# Altium project BBTC.PrjPcb
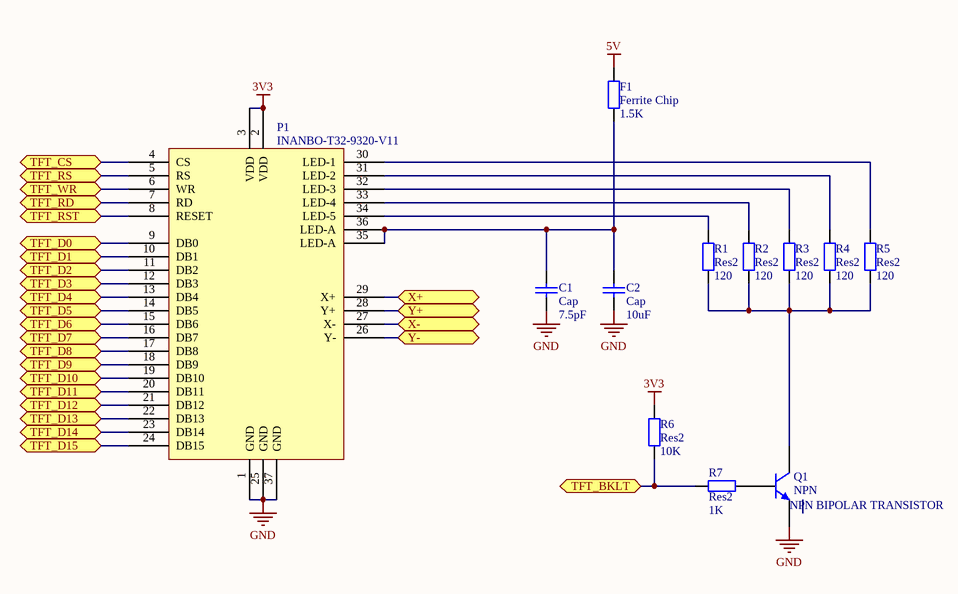
[diagram p0: LCD.SchDoc]
5 sheets, 98 parts. Net scope: flat (ports and power ports of the same name join across sheets).
Sheets:
  LCD.SchDoc
  MAIN.SchDoc
  WIFI.SchDoc
  PSU.SchDoc
  WIRING.SchDoc

## Sheet LCD.SchDoc
size A

### Parts
(Parts that share a designator on the sheet are numbered #1, #2 ... from top to bottom, then left to right.)
C1  Cap  value 7.5pF  [0603]
C2  Cap  value 10uF  [0805]
F1  Ferrite Chip  value 1.5K  [0603]
P1#1  INANBO-T32-9320-V11  [INANBO-T32-ILI9320-V11]
Q1#1  NPN  value NPN BIPOLAR TRANSISTOR  [SOT23_M]
R1#1  Res2  value 120  [0603]
R2#1  Res2  value 120  [0603]
R3  Res2  value 120  [0603]
R4  Res2  value 120  [0603]
R5  Res2  value 120  [0603]
R6  Res2  value 10K  [0603]
R7  Res2  value 1K  [0603]

### Ports
TFT_BKLT, TFT_CS, TFT_D0, TFT_D1, TFT_D2, TFT_D3, TFT_D4, TFT_D5, TFT_D6, TFT_D7, TFT_D8, TFT_D9, TFT_D10, TFT_D11, TFT_D12, TFT_D13, TFT_D14, TFT_D15, TFT_RD, TFT_RS, TFT_RST, TFT_WR, X+, X-, Y+, Y-

### Nets
3V3: P1#1.2(VDD) P1#1.3(VDD) R6.2
5V: F1.1
GND: C1.1 C2.1 P1#1.1(GND) P1#1.25(GND) P1#1.37(GND) Q1#1.3(E)
D0: P1#1.9(DB0) ; port TFT_D0
D1: P1#1.10(DB1) ; port TFT_D1
D2: P1#1.11(DB2) ; port TFT_D2
D3: P1#1.12(DB3) ; port TFT_D3
D4: P1#1.13(DB4) ; port TFT_D4
D5: P1#1.14(DB5) ; port TFT_D5
D6: P1#1.15(DB6) ; port TFT_D6
D7: P1#1.16(DB7) ; port TFT_D7
D8: P1#1.17(DB8) ; port TFT_D8
D9: P1#1.18(DB9) ; port TFT_D9
D10: P1#1.19(DB10) ; port TFT_D10
D11: P1#1.20(DB11) ; port TFT_D11
D12: P1#1.21(DB12) ; port TFT_D12
D13: P1#1.22(DB13) ; port TFT_D13
D14: P1#1.23(DB14) ; port TFT_D14
D15: P1#1.24(DB15) ; port TFT_D15
TFT_BKLT: R6.1 R7.2 ; port TFT_BKLT
TFT_CS: P1#1.4(CS) ; port TFT_CS
TFT_RD: P1#1.7(RD) ; port TFT_RD
TFT_RS: P1#1.5(RS) ; port TFT_RS
TFT_RST: P1#1.8(RESET) ; port TFT_RST
TFT_WR: P1#1.6(WR) ; port TFT_WR
X+: P1#1.29(X+) ; port X+
X-: P1#1.27(X-) ; port X-
Y+: P1#1.28(Y+) ; port Y+
Y-: P1#1.26(Y-) ; port Y-
NetC1_2: C1.2 C2.2 F1.2 P1#1.35(LED-A) P1#1.36(LED-A)
NetP1#1_30: P1#1.30(LED-1) R5.2
NetP1#1_31: P1#1.31(LED-2) R4.2
NetP1#1_32: P1#1.32(LED-3) R3.2
NetP1#1_33: P1#1.33(LED-4) R2#1.2
NetP1#1_34: P1#1.34(LED-5) R1#1.2
NetQ1#1_1: Q1#1.1(C) R1#1.1 R2#1.1 R3.1 R4.1 R5.1
NetQ1#1_2: Q1#1.2(B) R7.1

### Library data of the parts
C1 C2 = Cap: Capacitor; Supplier 1: Digi-Key
  C1: Supplier Part Number 1: 490-3565-1-ND
  C2: Supplier Part Number 1: 445-6857-1-ND
F1 = Res2: Supplier 1: Digi-Key; Supplier Part Number 1: 490-5216-1-ND
P1#1 = ER-TFT032-2: 3.2" TFT LCD module with touch panel; Supplier 1: INANBO; Supplier Part Number 1: INANBO-T32-9320-V11
Q1#1 = NPN: NPN Bipolar Transistor; pin to pad: 2>3 3>2; Supplier Part Number 1: MMBT2222ALT3GOSCT-ND; Supplier 1: Digi-Key
R1#1 R2#1 R3-R7 = Res2: Resistor; Supplier 1: Digi-Key
  R1#1 R2#1 R3-R5: Supplier Part Number 1: P120GCT-ND
  R6: Supplier Part Number 1: P10KGCT-ND
  R7: Supplier Part Number 1: 311-1.0KGRCT-ND

## Sheet MAIN.SchDoc
size B
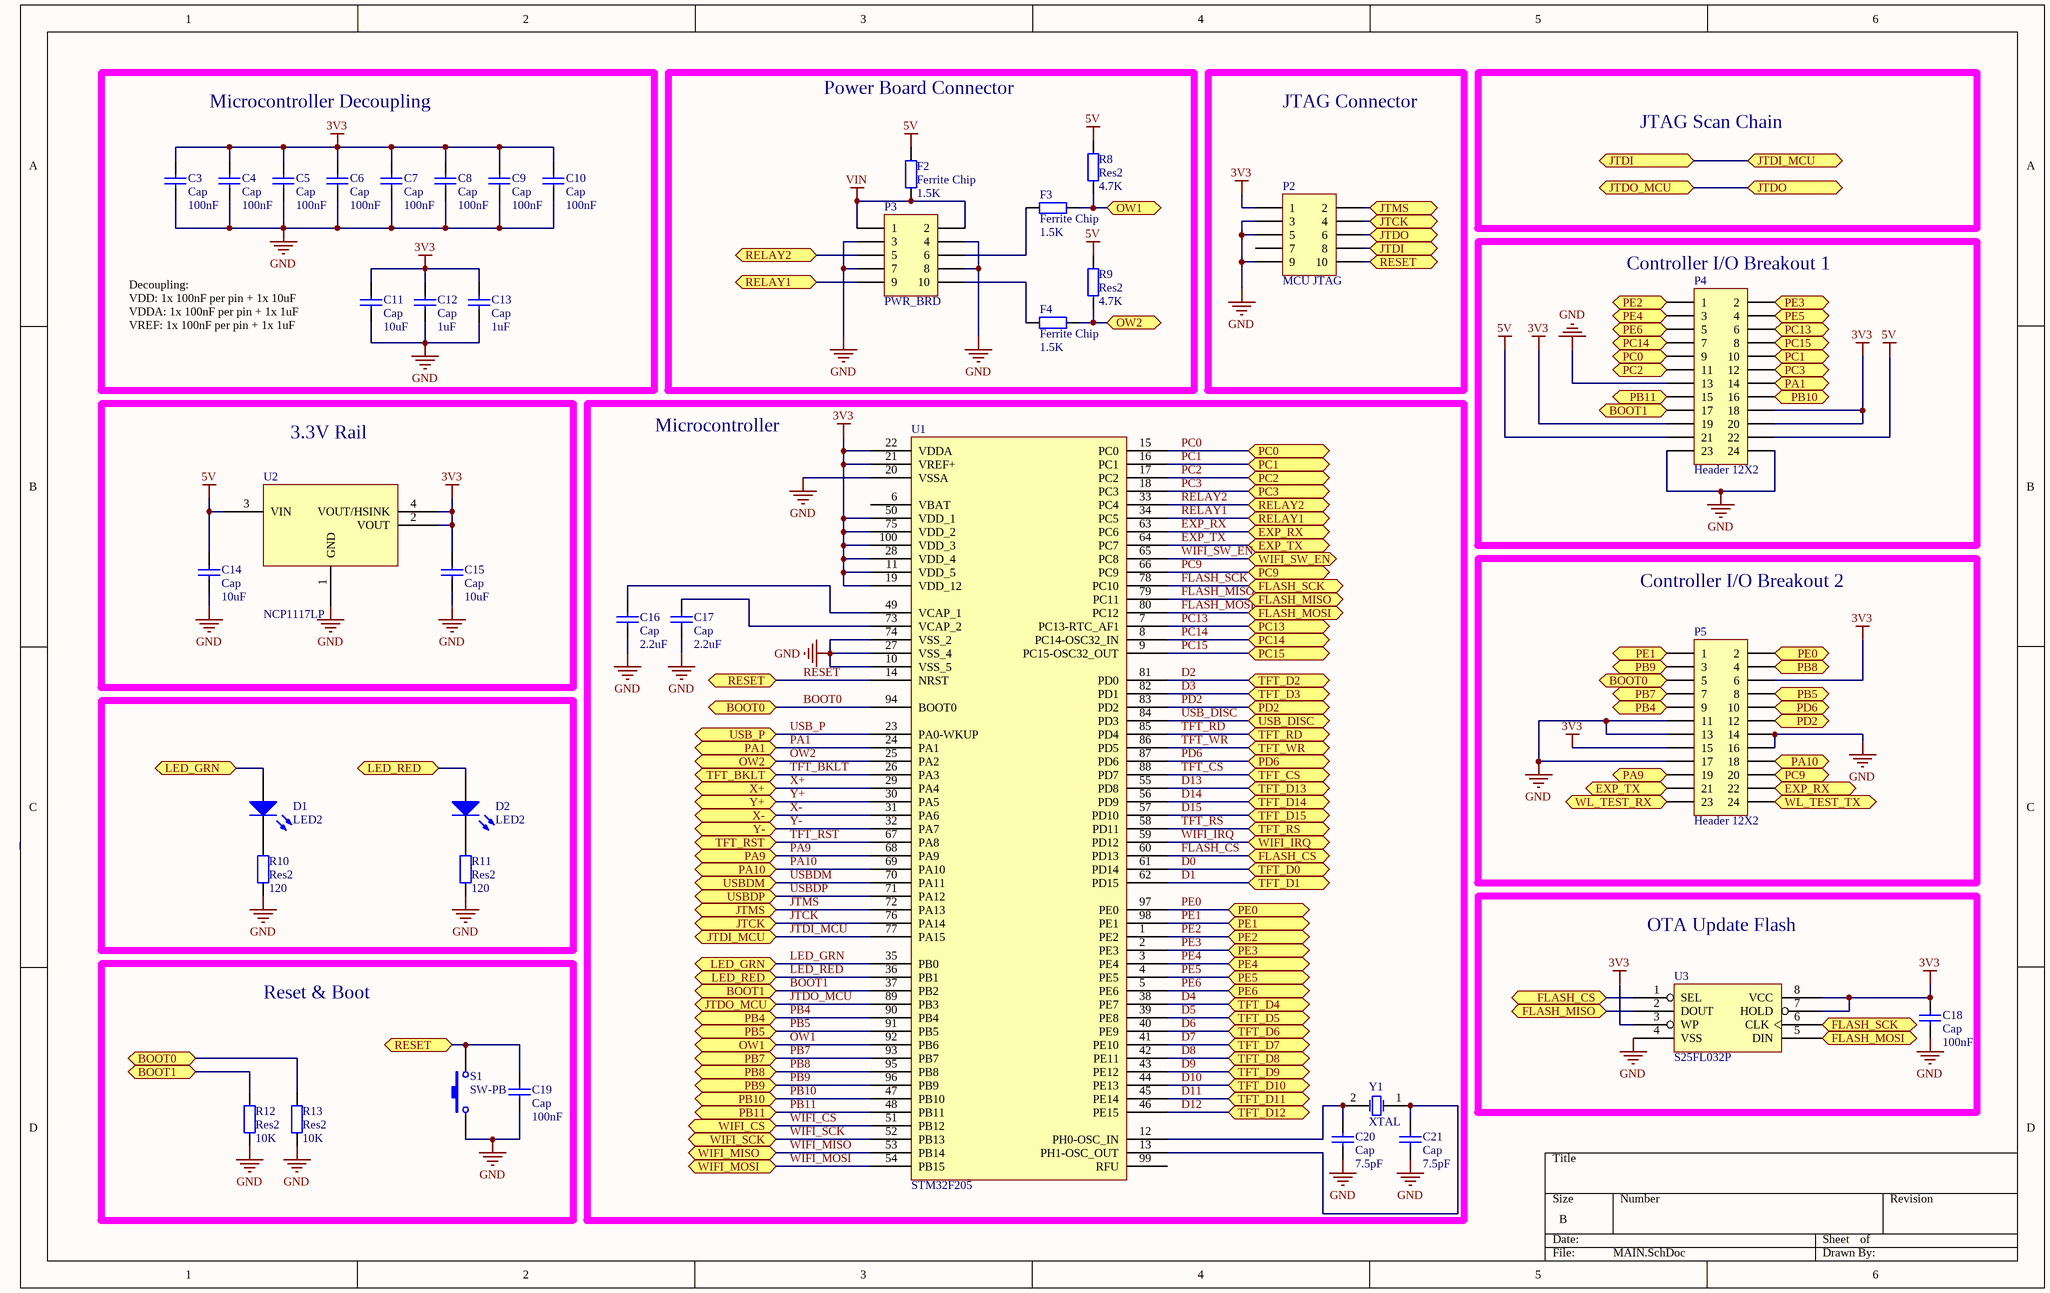
[diagram p1: MAIN.SchDoc]

### Parts
(Parts that share a designator on the sheet are numbered #1, #2 ... from top to bottom, then left to right.)
C3  Cap  value 100nF  [0603]
C4  Cap  value 100nF  [0603]
C5  Cap  value 100nF  [0603]
C6  Cap  value 100nF  [0603]
C7  Cap  value 100nF  [0603]
C8  Cap  value 100nF  [0603]
C9#1  Cap  value 100nF  [0603]
C10#1  Cap  value 100nF  [0603]
C11  Cap  value 10uF  [0805]
C12  Cap  value 1uF  [0603]
C13  Cap  value 1uF  [0603]
C14  Cap  value 10uF  [0805]
C15  Cap  value 10uF  [0805]
C16  Cap  value 2.2uF  [0603]
C17  Cap  value 2.2uF  [0603]
C18  Cap  value 100nF  [0603]
C19  Cap  value 100nF  [0603]
C20  Cap  value 7.5pF  [0603]
C21  Cap  value 7.5pF  [0603]
D1#1  LED2  [0603]
D2#1  LED2  [0603]
F2  Ferrite Chip  value 1.5K  [0603]
F3  Ferrite Chip  value 1.5K  [0603]
F4  Ferrite Chip  value 1.5K  [0603]
P2  MCU JTAG  [JTAG PTH]
P3  PWR_BRD  [HDR2X5]
P4#1  Header 12X2  [HDR2X12]
P5#1  Header 12X2  [HDR2X12]
R8  Res2  value 4.7K  [0603]
R9  Res2  value 4.7K  [0603]
R10  Res2  value 120  [0603]
R11  Res2  value 120  [0603]
R12  Res2  value 10K  [0603]
R13  Res2  value 10K  [0603]
S1  SW-PB  [FSM4JSMA]
U1  STM32F205  [LQFP-100]
U2  NCP1117LP  [SOT-223]
U3  S25FL032P  [SOC008]
Y1  XTAL  [HC49SD XTAL]

### Blocks framed on the sheet
Microcontroller Decoupling: C3-C8 C9#1 C10#1 C11-C13
Power Board Connector: F2-F4 P3 R8 R9
JTAG Connector: P2
Controller I/O Breakout 1: P4#1
3.3V Rail: C14 C15 U2
Microcontroller: C16 C17 C20 C21 U1 Y1
Controller I/O Breakout 2: P5#1
OTA Update Flash: C18 U3
Reset & Boot: C19 R12 R13 S1

### Ports
BOOT0, BOOT1, EXP_RX, EXP_TX, FLASH_CS, FLASH_MISO, FLASH_MOSI, FLASH_SCK, JTCK, JTDI, JTDI_MCU, JTDO, JTDO_MCU, JTMS, LED_GRN, LED_RED, OW1, OW2, PA1, PA9, PA10, PB4, PB5, PB7, PB8, PB9, PB10, PB11, PC0, PC1, PC2, PC3, PC9, PC13, PC14, PC15, PD2, PD6, PE0, PE1, PE2, PE3, PE4, PE5, PE6, RELAY1, RELAY2, RESET, TFT_BKLT, TFT_CS, TFT_D0, TFT_D1, TFT_D2, TFT_D3, TFT_D4, TFT_D5, TFT_D6, TFT_D7, TFT_D8, TFT_D9, TFT_D10, TFT_D11, TFT_D12, TFT_D13, TFT_D14, TFT_D15, TFT_RD, TFT_RS, TFT_RST, TFT_WR, USB_DISC, USB_P, USBDM, USBDP, WIFI_CS, WIFI_IRQ, WIFI_MISO, WIFI_MOSI, WIFI_SCK, WIFI_SW_EN, WL_TEST_RX, WL_TEST_TX, X+, X-, Y+, Y-

### Nets
3V3: C3.2 C4.2 C5.2 C6.2 C7.2 C8.2 C9#1.2 C10#1.2 C11.2 C12.2 C13.2 C15.2 C18.2 P2.1 P4#1.18 P4#1.19 P4#1.20 P5#1.6 P5#1.15 U1.11(VDD_5) U1.19(VDD_12) U1.21(VREF+) U1.22(VDDA) U1.28(VDD_4) U1.50(VDD_1) U1.75(VDD_2) U1.100(VDD_3) U2.2(VOUT) U2.4(VOUT/HSINK) U3.3(WP) U3.7(HOLD) U3.8(VCC)
5V: C14.2 F2.2 P4#1.21 P4#1.22 R8.2 R9.2 U2.3(VIN)
GND: C3.1 C4.1 C5.1 C6.1 C7.1 C8.1 C9#1.1 C10#1.1 C11.1 C12.1 C13.1 C14.1 C15.1 C16.1 C17.1 C18.1 C19.1 C20.1 C21.1 P2.3 P2.5 P2.9 P3.3 P3.4 P3.7 P3.8 P4#1.13 P4#1.23 P4#1.24 P5#1.11 P5#1.13 P5#1.14 P5#1.16 P5#1.17 R10.1 R11.1 R12.1 R13.1 S1.1 U1.10(VSS_5) U1.20(VSSA) U1.27(VSS_4) U1.74(VSS_2) U2.1(GND) U3.4(VSS)
VIN: F2.1 P3.1 P3.2
BOOT0: P5#1.5 R13.2 U1.94(BOOT0) ; port BOOT0
BOOT1: P4#1.17 R12.2 U1.37(PB2) ; port BOOT1
D0: U1.61(PD14) ; port TFT_D0
D1: U1.62(PD15) ; port TFT_D1
D2: U1.81(PD0) ; port TFT_D2
D3: U1.82(PD1) ; port TFT_D3
D4: U1.38(PE7) ; port TFT_D4
D5: U1.39(PE8) ; port TFT_D5
D6: U1.40(PE9) ; port TFT_D6
D7: U1.41(PE10) ; port TFT_D7
D8: U1.42(PE11) ; port TFT_D8
D9: U1.43(PE12) ; port TFT_D9
D10: U1.44(PE13) ; port TFT_D10
D11: U1.45(PE14) ; port TFT_D11
D12: U1.46(PE15) ; port TFT_D12
D13: U1.55(PD8) ; port TFT_D13
D14: U1.56(PD9) ; port TFT_D14
D15: U1.57(PD10) ; port TFT_D15
EXP_RX: P5#1.22 U1.63(PC6) ; port EXP_RX
EXP_TX: P5#1.21 U1.64(PC7) ; port EXP_TX
FLASH_CS: U1.60(PD13) U3.1(SEL) ; port FLASH_CS
FLASH_MISO: U1.79(PC11) U3.2(DOUT) ; port FLASH_MISO
FLASH_MOSI: U1.80(PC12) U3.5(DIN) ; port FLASH_MOSI
FLASH_SCK: U1.78(PC10) U3.6(CLK) ; port FLASH_SCK
JTCK: P2.4 U1.76(PA14) ; port JTCK
JTDI_MCU: P2.8 U1.77(PA15) ; port JTDI, port JTDI_MCU
JTDO_MCU: P2.6 U1.89(PB3) ; port JTDO, port JTDO_MCU
JTMS: P2.2 U1.72(PA13) ; port JTMS
LED_GRN: D1#1.1(A) U1.35(PB0) ; port LED_GRN
LED_RED: D2#1.1(A) U1.36(PB1) ; port LED_RED
OW1: F3.1 R8.1 U1.92(PB6) ; port OW1
OW2: F4.1 R9.1 U1.25(PA2) ; port OW2
PA1: P4#1.14 U1.24(PA1) ; port PA1
PA9: P5#1.19 U1.68(PA9) ; port PA9
PA10: P5#1.18 U1.69(PA10) ; port PA10
PB4: P5#1.9 U1.90(PB4) ; port PB4
PB5: P5#1.8 U1.91(PB5) ; port PB5
PB7: P5#1.7 U1.93(PB7) ; port PB7
PB8: P5#1.4 U1.95(PB8) ; port PB8
PB9: P5#1.3 U1.96(PB9) ; port PB9
PB10: P4#1.16 U1.47(PB10) ; port PB10
PB11: P4#1.15 U1.48(PB11) ; port PB11
PC0: P4#1.9 U1.15(PC0) ; port PC0
PC1: P4#1.10 U1.16(PC1) ; port PC1
PC2: P4#1.11 U1.17(PC2) ; port PC2
PC3: P4#1.12 U1.18(PC3) ; port PC3
PC9: P5#1.20 U1.66(PC9) ; port PC9
PC13: P4#1.6 U1.7(PC13-RTC_AF1) ; port PC13
PC14: P4#1.7 U1.8(PC14-OSC32_IN) ; port PC14
PC15: P4#1.8 U1.9(PC15-OSC32_OUT) ; port PC15
PD2: P5#1.12 U1.83(PD2) ; port PD2
PD6: P5#1.10 U1.87(PD6) ; port PD6
PE0: P5#1.2 U1.97(PE0) ; port PE0
PE1: P5#1.1 U1.98(PE1) ; port PE1
PE2: P4#1.1 U1.1(PE2) ; port PE2
PE3: P4#1.2 U1.2(PE3) ; port PE3
PE4: P4#1.3 U1.3(PE4) ; port PE4
PE5: P4#1.4 U1.4(PE5) ; port PE5
PE6: P4#1.5 U1.5(PE6) ; port PE6
RELAY1: P3.9 U1.34(PC5) ; port RELAY1  [project net R1_CTL]
RELAY2: P3.5 U1.33(PC4) ; port RELAY2  [project net R2_CTL]
RESET: C19.2 P2.10 S1.2 U1.14(NRST) ; port RESET
TFT_BKLT: U1.26(PA3) ; port TFT_BKLT
TFT_CS: U1.88(PD7) ; port TFT_CS
TFT_RD: U1.85(PD4) ; port TFT_RD
TFT_RS: U1.58(PD11) ; port TFT_RS
TFT_RST: U1.67(PA8) ; port TFT_RST
TFT_WR: U1.86(PD5) ; port TFT_WR
USB_DISC: U1.84(PD3) ; port USB_DISC
USB_P: U1.23(PA0-WKUP) ; port USB_P
USBDM: U1.70(PA11) ; port USBDM
USBDP: U1.71(PA12) ; port USBDP
WIFI_CS: U1.51(PB12) ; port WIFI_CS
WIFI_IRQ: U1.59(PD12) ; port WIFI_IRQ
WIFI_MISO: U1.53(PB14) ; port WIFI_MISO
WIFI_MOSI: U1.54(PB15) ; port WIFI_MOSI
WIFI_SCK: U1.52(PB13) ; port WIFI_SCK
WIFI_SW_EN: U1.65(PC8) ; port WIFI_SW_EN
WTR: P5#1.23 ; port WL_TEST_RX
WTT: P5#1.24 ; port WL_TEST_TX
X+: U1.29(PA4) ; port X+
X-: U1.31(PA6) ; port X-
Y+: U1.30(PA5) ; port Y+
Y-: U1.32(PA7) ; port Y-
NetC16_2: C16.2 U1.49(VCAP_1)
NetC17_2: C17.2 U1.73(VCAP_2)
NetC20_2: C20.2 U1.12(PH0-OSC_IN) Y1.2(OSC2)
NetC21_2: C21.2 U1.13(PH1-OSC_OUT) Y1.1(OSC1)
NetD1#1_2: D1#1.2(K) R10.2
NetD2#1_2: D2#1.2(K) R11.2
NetF3_2: F3.2 P3.6
NetF4_2: F4.2 P3.10

Not connected (* = marked no-connect by the designer): P2 7; U1 6(VBAT) 99(RFU)

### Notes on the sheet
- JTAG Scan Chain
- Decoupling:
  VDD: 1x 100nF per pin + 1x 10uF
  VDDA: 1x 100nF per pin + 1x 1uF
  VREF: 1x 100nF per pin + 1x 1uF

### Library data of the parts
C3-C8 C9#1 C10#1 C11-C21 = Cap: Capacitor; Supplier 1: Digi-Key
  C3-C8 C9#1 C10#1 C18 C19: Supplier Part Number 1: 399-1095-1-ND
  C11 C14 C15: Supplier Part Number 1: 445-6857-1-ND
  C12 C13: Supplier Part Number 1: 587-1242-1-ND
  C16 C17: Supplier Part Number 1: 587-2983-1-ND
  C20 C21: Supplier Part Number 1: 490-3565-1-ND
D1#1 D2#1 = LED2: Typical RED, GREEN, YELLOW, AMBER GaAs LED; Supplier 1: Digi-Key
  D1#1: Supplier Part Number 1: 160-1183-1-ND
  D2#1: Supplier Part Number 1: 160-1181-1-ND
F2-F4 = Res2: Supplier 1: Digi-Key; Supplier Part Number 1: 490-5216-1-ND
P2 P3 = Header 5X2: Header, 5-Pin, Dual row; Supplier 1: Digi-Key
  P2: Supplier Part Number 1: 609-3712-ND
  P3: Supplier Part Number 1: ED1543-ND
P4#1 P5#1 = Header 12X2: Header, 12-Pin, Dual row; Supplier 1: Digi-Key
R8-R13 = Res2: Resistor; Supplier 1: Digi-Key
  R8 R9: Supplier Part Number 1: 311-4.7KGRCT-ND
  R10 R11: Supplier Part Number 1: P120GCT-ND
  R12 R13: Supplier Part Number 1: P10KGCT-ND
S1 = SW-PB: Switch; Supplier Part Number 1: 450-1759-1-ND; Supplier 1: Digi-Key
U1 = STM32F20x-LQFP100: STMicroelectronics STM32F20x LQFP100; Supplier 1: Digi-Key; Supplier Part Number 1: 497-11161-ND
U2 = NCP1117LP: 1.0 A Low-Dropout Positive  Fixed and Adjustable  Voltage Regulators; Supplier 1: Digi-Key; Supplier Part Number 1: NCP1117LPST33T3GOSCT-ND
U3 = M25P80-VMN6TP: IC FLASH 8MBIT 75MHZ SO8N; Supplier 1: Digi-Key; Supplier Part Number 1: S25FL032P0XMFI011-ND
Y1 = XTAL: Crystal Oscillator; Supplier 1: Digi-Key; Supplier Part Number 1: 631-1010-1-ND

## Sheet WIFI.SchDoc
size A
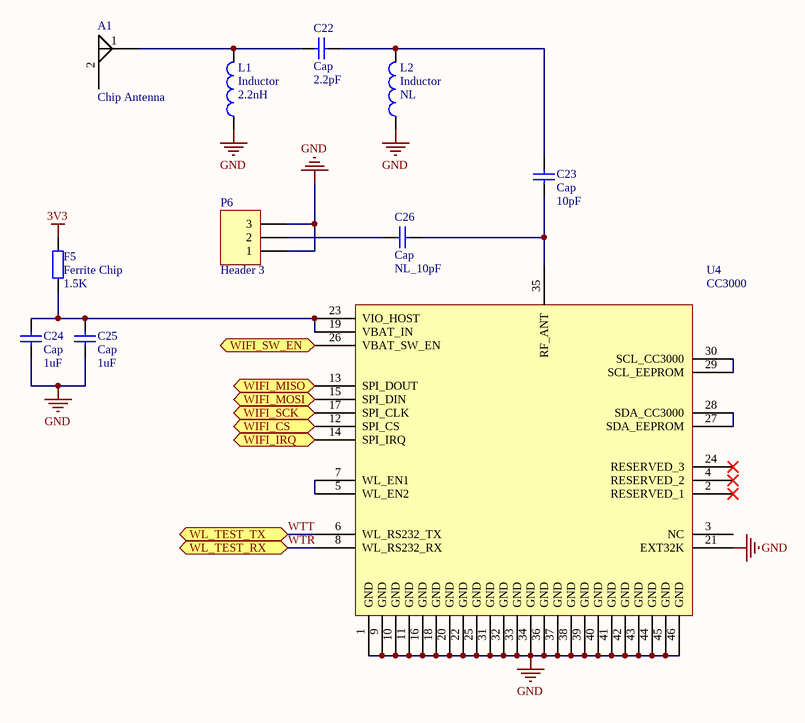
[diagram p2: WIFI.SchDoc]

### Parts
(Parts that share a designator on the sheet are numbered #1, #2 ... from top to bottom, then left to right.)
A1  Chip Antenna  [2500AT44M0400]
C22  Cap  value 2.2pF  [0402]
C23  Cap  value 10pF  [0402]
C24  Cap  value 1uF  [0603]
C25  Cap  value 1uF  [0603]
C26  Cap  value NL_10pF  [0402]
F5  Ferrite Chip  value 1.5K  [0603]
L1  Inductor  value 2.2nH  [0402]
L2  Inductor  value NL  [0402]
P6#1  Header 3  [U.FL-R-SMT-1]
U4  CC3000  [CC3000]

### Ports
WIFI_CS, WIFI_IRQ, WIFI_MISO, WIFI_MOSI, WIFI_SCK, WIFI_SW_EN, WL_TEST_RX, WL_TEST_TX

### Nets
3V3: F5.2
GND: C24.1 C25.1 L1.1 L2.1 P6#1.1 P6#1.3 U4.1(GND) U4.9(GND) U4.10(GND) U4.11(GND) U4.16(GND) U4.18(GND) U4.20(GND) U4.21(EXT32K) U4.22(GND) U4.25(GND) U4.31(GND) U4.32(GND) U4.33(GND) U4.34(GND) U4.36(GND) U4.37(GND) U4.38(GND) U4.39(GND) U4.40(GND) U4.41(GND) U4.42(GND) U4.43(GND) U4.44(GND) U4.45(GND) U4.46(GND)
WIFI_CS: U4.12(SPI_CS) ; port WIFI_CS
WIFI_IRQ: U4.14(SPI_IRQ) ; port WIFI_IRQ
WIFI_MISO: U4.13(SPI_DOUT) ; port WIFI_MISO
WIFI_MOSI: U4.15(SPI_DIN) ; port WIFI_MOSI
WIFI_SCK: U4.17(SPI_CLK) ; port WIFI_SCK
WIFI_SW_EN: U4.26(VBAT_SW_EN) ; port WIFI_SW_EN
WTR: U4.8(WL_RS232_RX) ; port WL_TEST_RX
WTT: U4.6(WL_RS232_TX) ; port WL_TEST_TX
NetA1_1: A1.1 C22.2 L1.2
NetC22_1: C22.1 C23.2 L2.2
NetC23_1: C23.1 C26.1 U4.35(RF_ANT)
NetC24_2: C24.2 C25.2 F5.1 U4.19(VBAT_IN) U4.23(VIO_HOST)
NetC26_2: C26.2 P6#1.2
NetU4_5: U4.5(WL_EN2) U4.7(WL_EN1)
NetU4_27: U4.27(SDA_EEPROM) U4.28(SDA_CC3000)
NetU4_29: U4.29(SCL_EEPROM) U4.30(SCL_CC3000)

Not connected (* = marked no-connect by the designer): A1 2; U4 2(RESERVED_1)* 3(NC) 4(RESERVED_2)* 24(RESERVED_3)*

### Library data of the parts
A1 = ANT-SMT-2: Supplier 1: Digi-Key; Supplier Part Number 1: 712-1403-1-ND
C22-C26 = Cap: Capacitor; Supplier 1: Digi-Key
  C22: Supplier Part Number 1: 490-5932-1-ND
  C23 C26: Supplier Part Number 1: 311-1014-1-ND
  C24 C25: Supplier Part Number 1: 587-1242-1-ND
F5 = Res2: Supplier 1: Digi-Key; Supplier Part Number 1: 490-5216-1-ND
P6#1 = Header 3: Header, 3-Pin; Supplier 1: Digi-Key
U4 = CC3000: CC3000 WLAN Module; Supplier 1: Digi-Key; Supplier Part Number 1: 296-35512-1-ND
L1 L2 = Inductor: Supplier Part Number 1: 712-1414-1-ND; Supplier 1: Digi-Key

## Sheet PSU.SchDoc
size B
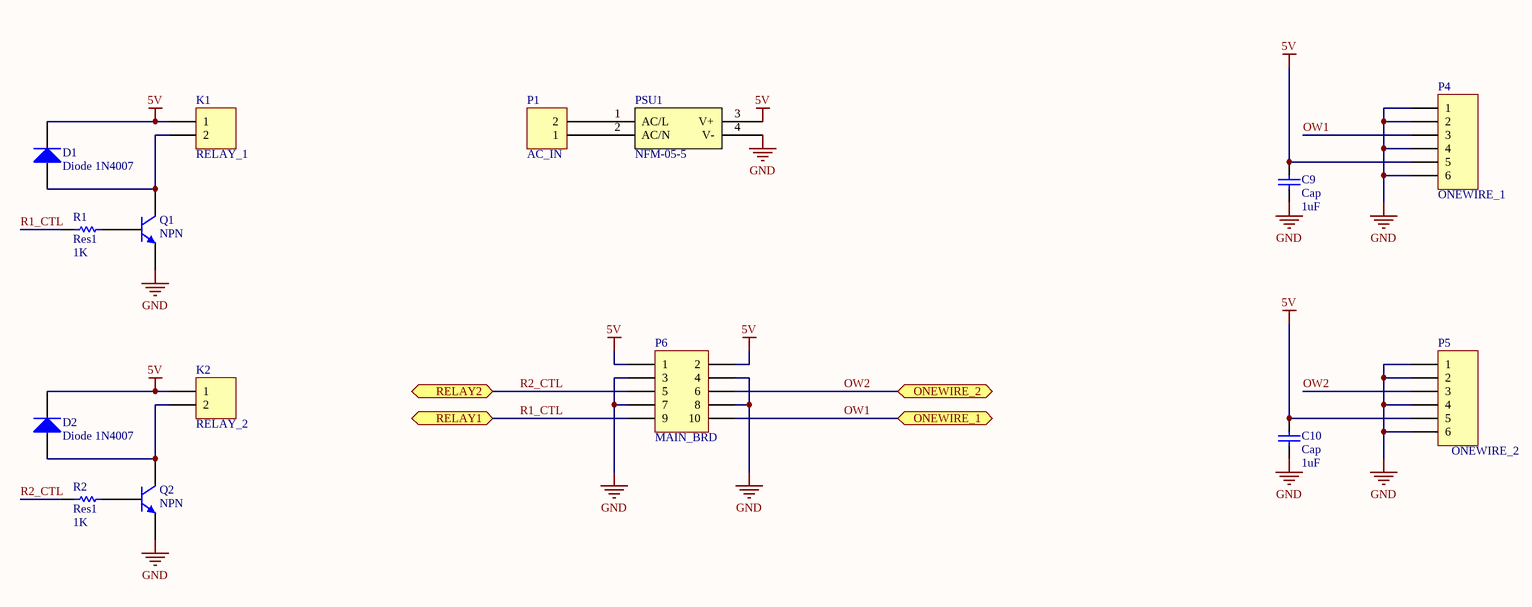
[diagram p3: PSU.SchDoc]

### Parts
(Parts that share a designator on the sheet are numbered #1, #2 ... from top to bottom, then left to right.)
C9#2  Cap  value 1uF  [RAD-0.2]
C10#2  Cap  value 1uF  [RAD-0.2]
D1#2  Diode 1N4007  [DO-41]
D2#2  Diode 1N4007  [DO-41]
K1  RELAY_1  [ALE12XXX]
K2  RELAY_2  [ALE12XXX]
P1#2  AC_IN  [2POS 0.312" HEADER]
P4#2  ONEWIRE_1  [CONN MOD JACK R/A 6P6C]
P5#2  ONEWIRE_2  [CONN MOD JACK R/A 6P6C]
P6#2  MAIN_BRD  [HDR2X5]
PSU1  NFM-05-5  [NFM-05-5]
Q1#2  NPN  [TO-92 BENT LEAD]
Q2  NPN  [TO-92 BENT LEAD]
R1#2  Res1  value 1K  [AXIAL-0.3]
R2#2  Res1  value 1K  [AXIAL-0.3]

### Ports
ONEWIRE_1, ONEWIRE_2, RELAY1, RELAY2

### Nets
5V: C9#2.2 C10#2.2 D1#2.2(K) D2#2.2(K) K1.1 K2.1 P4#2.5 P5#2.5 P6#2.1 P6#2.2 PSU1.3(V+)
GND: C9#2.1 C10#2.1 P4#2.1 P4#2.2 P4#2.4 P4#2.6 P5#2.1 P5#2.2 P5#2.4 P5#2.6 P6#2.3 P6#2.4 P6#2.7 P6#2.8 PSU1.4(V-) Q1#2.3(E) Q2.3(E)
OW1: P4#2.3 P6#2.10 ; port ONEWIRE_1
OW2: P5#2.3 P6#2.6 ; port ONEWIRE_2
R1_CTL: P6#2.9 R1#2.1 ; port RELAY1
R2_CTL: P6#2.5 R2#2.1 ; port RELAY2
NetD1#2_1: D1#2.1(A) K1.2 Q1#2.1(C)
NetD2#2_1: D2#2.1(A) K2.2 Q2.1(C)
NetP1#2_1: P1#2.1 PSU1.2(AC/N)
NetP1#2_2: P1#2.2 PSU1.1(AC/L)
NetQ1#2_2: Q1#2.2(B) R1#2.2
NetQ2_2: Q2.2(B) R2#2.2

### Library data of the parts
C9#2 C10#2 = Cap: Capacitor; Supplier 1: Digi-Key; Supplier Part Number 1: 445-8607-ND
D1#2 D2#2 = Diode 1N4007: 1 Amp General Purpose Rectifier; Supplier Part Number 1: 1N4007DICT-ND; Supplier 1: Digi-Key
K1 K2 P1#2 = Header 2: Header, 2-Pin; Supplier 1: Digi-Key
  K1 K2: Supplier Part Number 1: 255-1365-ND
  P1#2: Supplier Part Number 1: A106608-ND
P4#2 P5#2 = Header 6: Header, 6-Pin; Supplier Part Number 1: A105007CT-ND; Supplier 1: Digi-Key
P6#2 = Header 5X2: Header, 5-Pin, Dual row; Supplier Part Number 1: ED1543-ND; Supplier 1: Digi-Key
PSU1 = NFM-05-5: 5V 5W AC/DC Power Supply; Supplier Part Number 1: NFM-05-5; Supplier 1: Aulux
Q1#2 Q2 = NPN: NPN Bipolar Transistor; Supplier 1: Digi-Key; Supplier Part Number 1: BC547BBU-ND
R1#2 R2#2 = Res1: Resistor; Supplier 1: Digi-Key; Supplier Part Number 1: CF14JT1K00CT-ND

## Sheet WIRING.SchDoc: BrewBit Model T Wiring Harnesses
size A
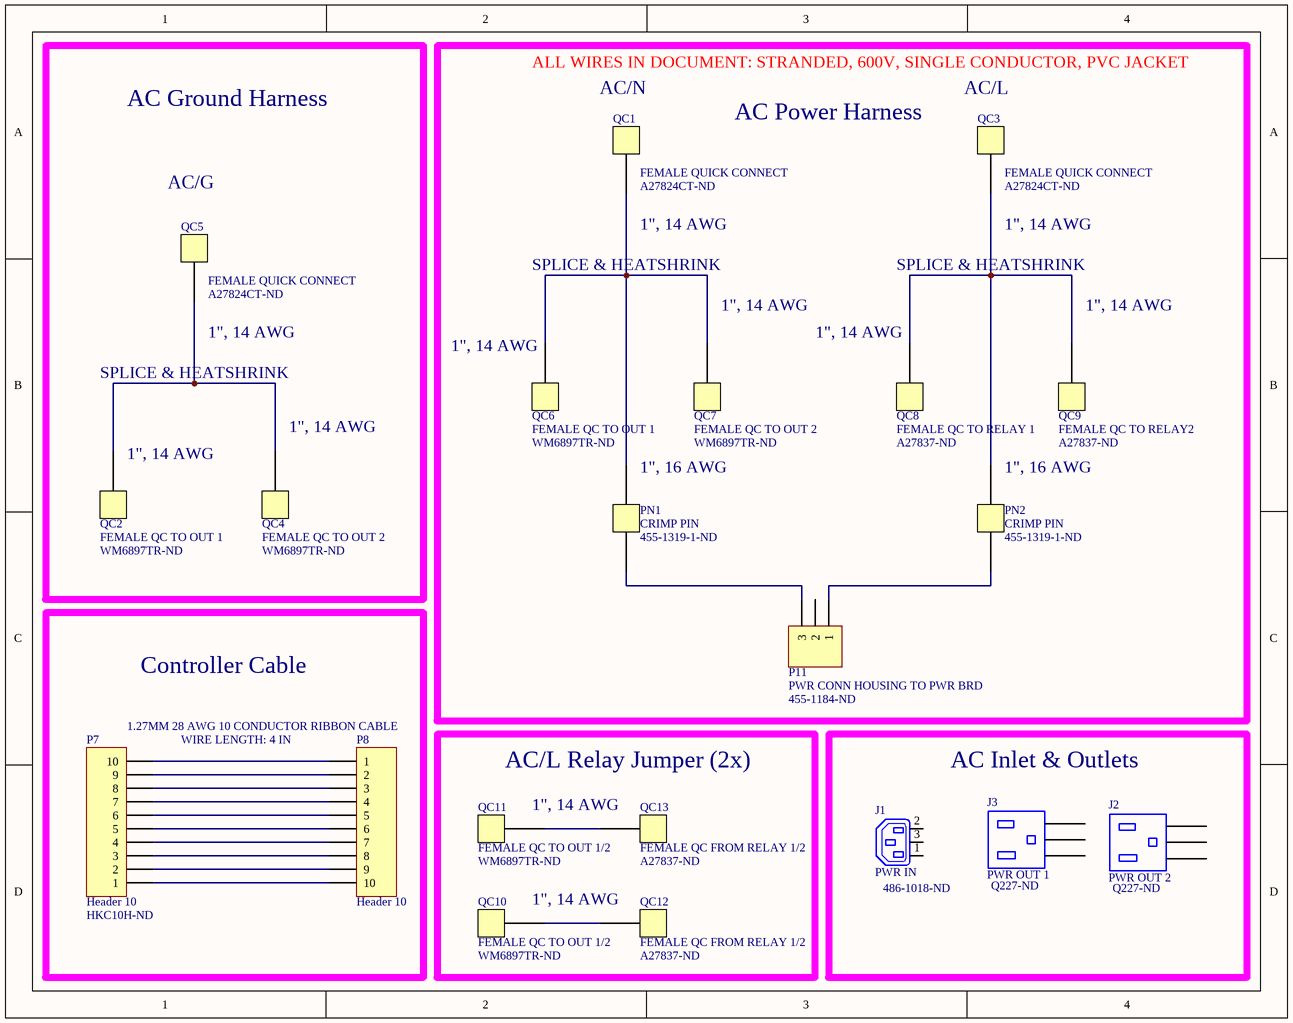
[diagram p4: WIRING.SchDoc]

### Parts
J1  PWR IN  Supplier Part Number 1: 486-1018-ND  [IEC7-2H3]
J2  PWR OUT 2  Supplier Part Number 1: Q227-ND
J3  PWR OUT 1  Supplier Part Number 1: Q227-ND
P7  Header 10  Supplier Part Number 1: HKC10H-ND
P8  Header 10
P11  PWR CONN HOUSING TO PWR BRD  Supplier Part Number 1: 455-1184-ND
PN1  CRIMP PIN  Supplier Part Number 1: 455-1319-1-ND
PN2  CRIMP PIN  Supplier Part Number 1: 455-1319-1-ND
QC1  FEMALE QUICK CONNECT  Supplier Part Number 1: A27824CT-ND
QC2  FEMALE QC TO OUT 1  Supplier Part Number 1: WM6897TR-ND
QC3  FEMALE QUICK CONNECT  Supplier Part Number 1: A27824CT-ND
QC4  FEMALE QC TO OUT 2  Supplier Part Number 1: WM6897TR-ND
QC5  FEMALE QUICK CONNECT  Supplier Part Number 1: A27824CT-ND
QC6  FEMALE QC TO OUT 1  Supplier Part Number 1: WM6897TR-ND
QC7  FEMALE QC TO OUT 2  Supplier Part Number 1: WM6897TR-ND
QC8  FEMALE QC TO RELAY 1  Supplier Part Number 1: A27837-ND
QC9  FEMALE QC TO RELAY2  Supplier Part Number 1: A27837-ND
QC10  FEMALE QC TO OUT 1/2  Supplier Part Number 1: WM6897TR-ND
QC11  FEMALE QC TO OUT 1/2  Supplier Part Number 1: WM6897TR-ND
QC12  FEMALE QC FROM RELAY 1/2  Supplier Part Number 1: A27837-ND
QC13  FEMALE QC FROM RELAY 1/2  Supplier Part Number 1: A27837-ND

### Blocks framed on the sheet
AC Ground Harness: QC2 QC4 QC5
AC Power Harness: P11 PN1 PN2 QC1 QC3 QC6-QC9
Controller Cable: P7 P8
AC/L Relay Jumper (2x): QC10-QC13
AC Inlet & Outlets: J1-J3

### Nets
NetP7_1: P7.1 P8.10
NetP7_2: P7.2 P8.9
NetP7_3: P7.3 P8.8
NetP7_4: P7.4 P8.7
NetP7_5: P7.5 P8.6
NetP7_6: P7.6 P8.5
NetP7_7: P7.7 P8.4
NetP7_8: P7.8 P8.3
NetP7_9: P7.9 P8.2
NetP7_10: P7.10 P8.1
NetP11_1: P11.1 PN2.?2
NetP11_3: P11.3 PN1.?2
NetPN1_?1: PN1.?1 QC1.?1 QC6.?1 QC7.?1
NetPN2_?1: PN2.?1 QC3.?1 QC8.?1 QC9.?1
NetQC2_?1: QC2.?1 QC4.?1 QC5.?1
NetQC10_?1: QC10.?1 QC12.?1
NetQC11_?1: QC11.?1 QC13.?1

Not connected (* = marked no-connect by the designer): J1 1(L) 2(N) 3(E); J2 ?1 ?2 ?3; J3 ?1 ?2 ?3; P11 2

### Notes on the sheet
- ALL WIRES IN DOCUMENT: STRANDED, 600V, SINGLE CONDUCTOR, PVC JACKET
- AC/N
- AC/L
- AC/G
- 1", 14 AWG
- SPLICE & HEATSHRINK
- (near QC6) 1", 14 AWG
- (near QC8) 1", 14 AWG
- (near QC2) 1", 14 AWG
- (near PN1) 1", 16 AWG
- (near PN2) 1", 16 AWG
- 1.27MM 28 AWG 10 CONDUCTOR RIBBON CABLE
- WIRE LENGTH: 4 IN

### Library data of the parts
J1 = Plug AC Female: IEC Mains Power Outlet, EN60 320-2-2 F Class I, PC Flange Rear Mount, Chassis Socket; Supplier 1: Digi-Key
J2 J3 = PWR OUTLET: Supplier 1: Digi-Key
P7 P8 = Header 10: Header, 10-Pin; Supplier 1: Digi-Key
  P8: Supplier Part Number 1: HKC10H-ND
P11 = Header 3: POWER CONNECTOR HOUSING; Supplier 1: Digi-Key
QC1-QC13 = QUICK CONNECT: Supplier 1: Digi-Key
PN1 PN2 = CRIMP PIN: Supplier 1: Digi-Key

## Nets that join several sheets
3V3: LCD (P1#1.2 P1#1.3 R6.2), MAIN (32 pins), WIFI (F5.2)
5V: LCD (F1.1), MAIN (7 pins), PSU (11 pins)
GND: LCD (6 pins), MAIN (45 pins), WIFI (31 pins), PSU (17 pins)
D0: LCD (P1#1.9), MAIN (U1.61)
D1: LCD (P1#1.10), MAIN (U1.62)
D2: LCD (P1#1.11), MAIN (U1.81)
D3: LCD (P1#1.12), MAIN (U1.82)
D4: LCD (P1#1.13), MAIN (U1.38)
D5: LCD (P1#1.14), MAIN (U1.39)
D6: LCD (P1#1.15), MAIN (U1.40)
D7: LCD (P1#1.16), MAIN (U1.41)
D8: LCD (P1#1.17), MAIN (U1.42)
D9: LCD (P1#1.18), MAIN (U1.43)
D10: LCD (P1#1.19), MAIN (U1.44)
D11: LCD (P1#1.20), MAIN (U1.45)
D12: LCD (P1#1.21), MAIN (U1.46)
D13: LCD (P1#1.22), MAIN (U1.55)
D14: LCD (P1#1.23), MAIN (U1.56)
D15: LCD (P1#1.24), MAIN (U1.57)
R1_CTL: MAIN (P3.9 U1.34), PSU (P6#2.9 R1#2.1)
R2_CTL: MAIN (P3.5 U1.33), PSU (P6#2.5 R2#2.1)
TFT_BKLT: LCD (R6.1 R7.2), MAIN (U1.26)
TFT_CS: LCD (P1#1.4), MAIN (U1.88)
TFT_RD: LCD (P1#1.7), MAIN (U1.85)
TFT_RS: LCD (P1#1.5), MAIN (U1.58)
TFT_RST: LCD (P1#1.8), MAIN (U1.67)
TFT_WR: LCD (P1#1.6), MAIN (U1.86)
WIFI_CS: MAIN (U1.51), WIFI (U4.12)
WIFI_IRQ: MAIN (U1.59), WIFI (U4.14)
WIFI_MISO: MAIN (U1.53), WIFI (U4.13)
WIFI_MOSI: MAIN (U1.54), WIFI (U4.15)
WIFI_SCK: MAIN (U1.52), WIFI (U4.17)
WIFI_SW_EN: MAIN (U1.65), WIFI (U4.26)
WTR: MAIN (P5#1.23), WIFI (U4.8)
WTT: MAIN (P5#1.24), WIFI (U4.6)
X+: LCD (P1#1.29), MAIN (U1.29)
X-: LCD (P1#1.27), MAIN (U1.31)
Y+: LCD (P1#1.28), MAIN (U1.30)
Y-: LCD (P1#1.26), MAIN (U1.32)